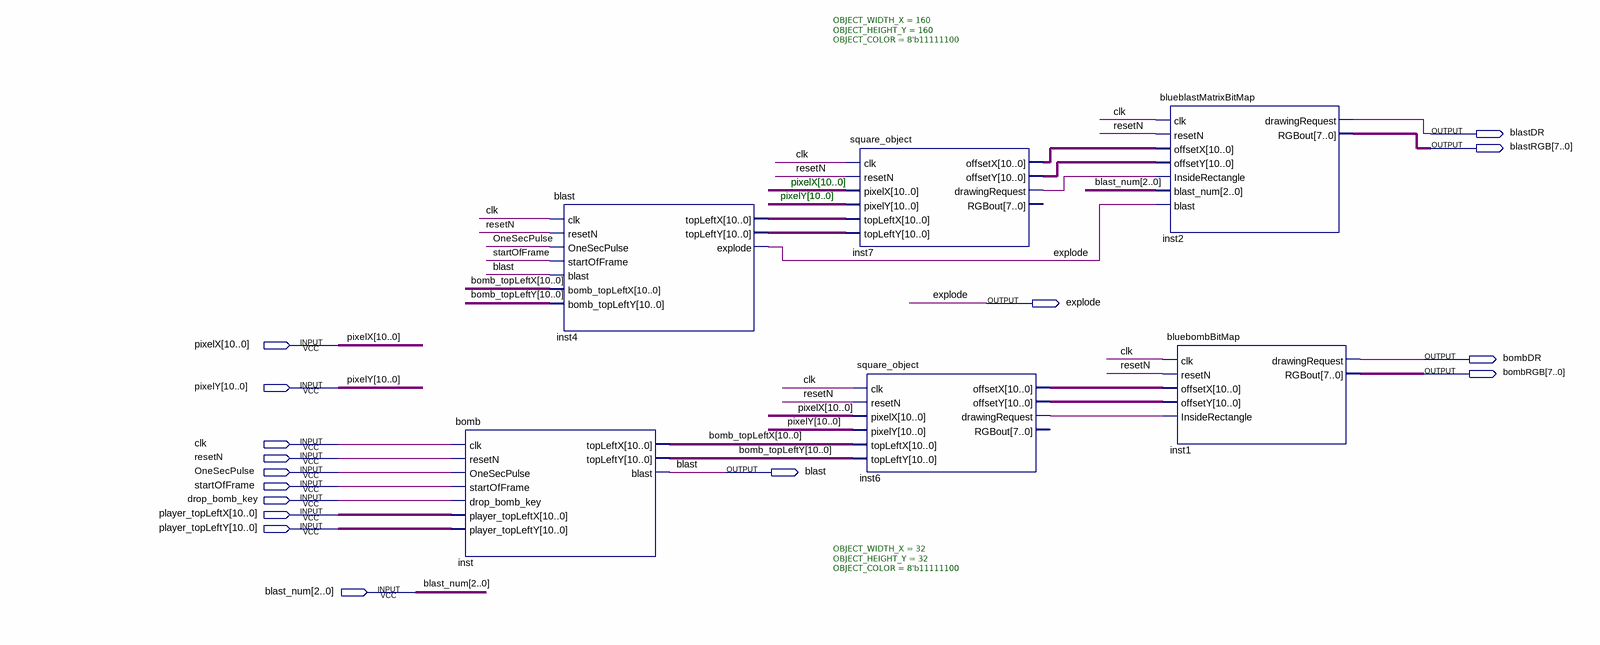
[diagram p0: schematic sheet]
// Quartus schematic Blue_Bomb_Block_T.bdf as structural Verilog: 6 symbols, 16 pins
module Blue_Bomb_Block_T (
  input  [10:0] pixelX,
  input  [10:0] pixelY,
  input  clk,
  input  resetN,
  input  OneSecPulse,
  input  startOfFrame,
  input  drop_bomb_key,
  input  [10:0] player_topLeftX,
  input  [10:0] player_topLeftY,
  input  [2:0] blast_num,
  output blastDR,
  output [7:0] blastRGB,
  output explode,
  output bombDR,
  output [7:0] bombRGB,
  output blast
);

  wire inst6_drawingrequest, inst7_drawingrequest;
  wire [10:0] bomb_topLeftX, bomb_topLeftY, inst4_topleftx, inst4_toplefty, inst6_offsetx, inst6_offsety,
       inst7_offsetx, inst7_offsety;

  bomb inst (
    .clk(clk), .resetN(resetN), .OneSecPulse(OneSecPulse), .startOfFrame(startOfFrame),
    .drop_bomb_key(drop_bomb_key), .player_topLeftX(player_topLeftX), .player_topLeftY(player_topLeftY),
    .topLeftX(bomb_topLeftX), .topLeftY(bomb_topLeftY), .blast(blast));
  blast inst4 (
    .clk(clk), .resetN(resetN), .OneSecPulse(OneSecPulse), .startOfFrame(startOfFrame), .blast(blast),
    .bomb_topLeftX(bomb_topLeftX), .bomb_topLeftY(bomb_topLeftY), .topLeftX(inst4_topleftx),
    .topLeftY(inst4_toplefty), .explode(explode));
  square_object #(.OBJECT_WIDTH_X(160), .OBJECT_HEIGHT_Y(160), .OBJECT_COLOR(8'b11111100)) inst7 (
    .clk(clk), .resetN(resetN), .pixelX(pixelX), .pixelY(pixelY), .topLeftX(inst4_topleftx),
    .topLeftY(inst4_toplefty), .offsetX(inst7_offsetx), .offsetY(inst7_offsety),
    .drawingRequest(inst7_drawingrequest));  // open: RGBout
  square_object #(.OBJECT_WIDTH_X(32), .OBJECT_HEIGHT_Y(32), .OBJECT_COLOR(8'b11111100)) inst6 (
    .clk(clk), .resetN(resetN), .pixelX(pixelX), .pixelY(pixelY), .topLeftX(bomb_topLeftX),
    .topLeftY(bomb_topLeftY), .offsetX(inst6_offsetx), .offsetY(inst6_offsety),
    .drawingRequest(inst6_drawingrequest));  // open: RGBout
  blueblastMatrixBitMap inst2 (
    .clk(clk), .resetN(resetN), .offsetX(inst7_offsetx), .offsetY(inst7_offsety),
    .InsideRectangle(inst7_drawingrequest), .blast_num(blast_num), .blast(explode), .drawingRequest(blastDR),
    .RGBout(blastRGB));
  bluebombBitMap inst1 (
    .clk(clk), .resetN(resetN), .offsetX(inst6_offsetx), .offsetY(inst6_offsety),
    .InsideRectangle(inst6_drawingrequest), .drawingRequest(bombDR), .RGBout(bombRGB));

  // Notes on the sheet:
  //   pixelX[10..0]
  //   pixelY[10..0]
endmodule
